# EAGLE design ph-sensor (EAGLE 9.1.1)
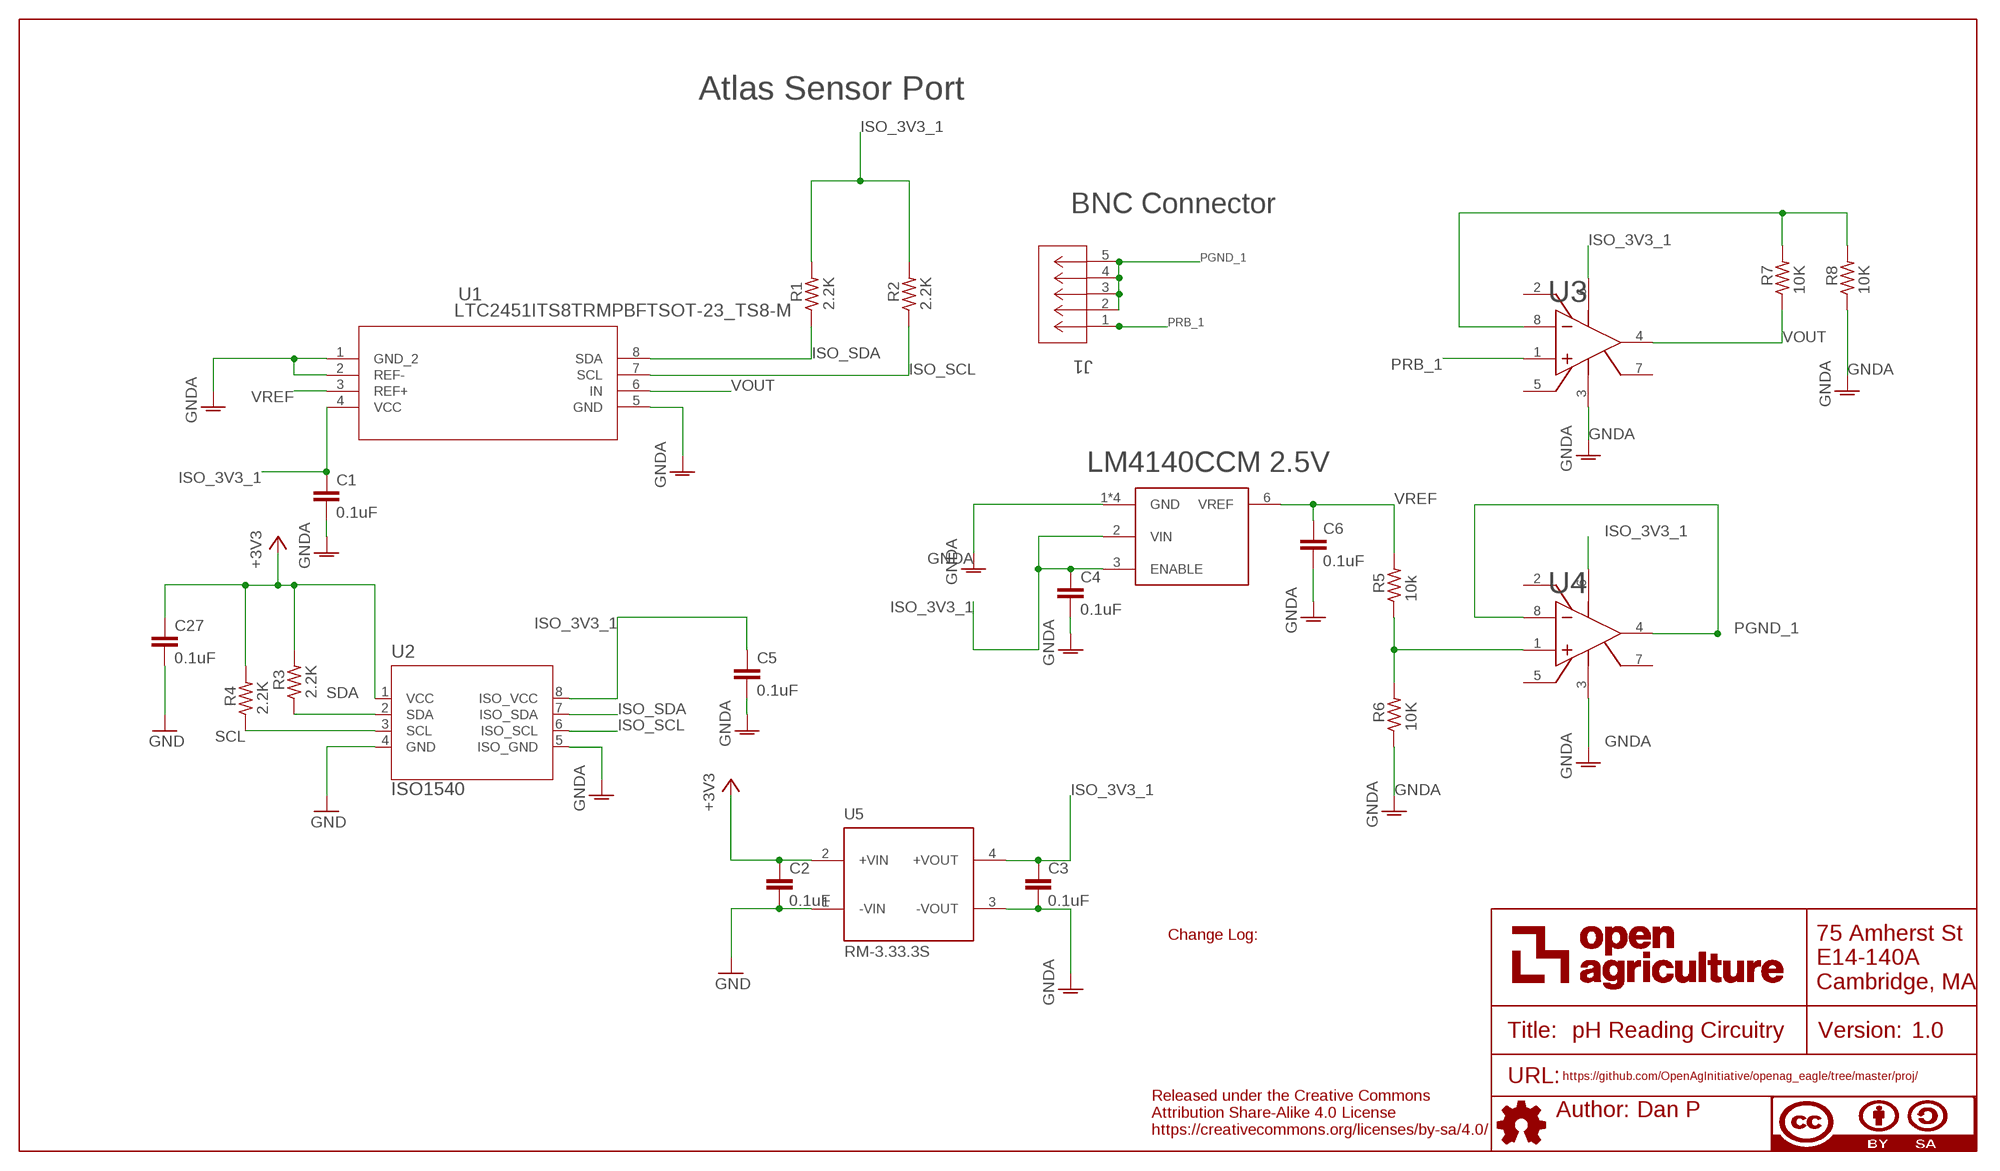
[diagram p0: schematic, sheet 1]
U$4 (DOCFIELD-SCHEMATIC-ONLY): AUTHOR: Dan P; MPN: N/A; TITLE: pH Reading Circuitry; URL: https://github.com/OpenAgInitiative/openag_eagle/tree/master/proj/; VER: 1.0

## Parts
C1  0.1uF  0.1UF-C0603C104K5RACTU  [C0603]
C2  0.1uF  0.1UF-C0603C104K5RACTU  [C0603]
C3  0.1uF  0.1UF-C0603C104K5RACTU  [C0603]
C4  0.1uF  0.1UF-C0603C104K5RACTU  [C0603]
C5  0.1uF  0.1UF-C0603C104K5RACTU  [C0603]
C6  0.1uF  0.1UF-C0603C104K5RACTU  [C0603]
C27  0.1uF  0.1UF-C0603C104K5RACTU  [C0603]
J1  5-1634503-1  [CONN5_5-1634503-1]
R1  2.2K  1K-ERJ-PB3D1001V  [RC0603N]
R2  2.2K  1K-ERJ-PB3D1001V  [RC0603N]
R3  2.2K  1K-ERJ-PB3D1001V  [RC0603N]
R4  2.2K  1K-ERJ-PB3D1001V  [RC0603N]
R5  10k  1K-ERJ-PB3D1001V  [RC0603N]
R6  10K  1K-ERJ-PB3D1001V  [RC0603N]
R7  10K  1K-ERJ-PB3D1001V  [RC0603N]
R8  10K  1K-ERJ-PB3D1001V  [RC0603N]
U1  LTC2451ITS8TRMPBFTSOT-23_TS8-M  [TSOT-23_TS8-M]
U2  ISO1540  ISO1540DR  [D8]
U3  LMP7721MA/NOPBM08A-M  [M08A-M]
U4  LMP7721MA/NOPBM08A-M  [M08A-M]
U5  RM-3.33.3S  RM3.33.3S  [RM3.33.3S-SIP4]
U$5  LM4140CCM_2.5V  LM4140  [SO08]

## Nets
+3V3: C2.1 C27.1 R3.2 R4.2 U2.1(VCC) U5.2(+VIN)
GND: C2.2 C27.2 U2.4(GND) U5.1(-VIN)
GNDA: C1.2 C3.2 C4.2 C5.2 C6.2 R6.1 R8.1 U1.1(GND_2) U1.2(REF-) U1.5(GND) U2.5(ISO_GND) U3.3(V-) U4.3(V-) U5.3(-VOUT) U$5.1(GND) U$5.4(GND) U$5.7(GND) U$5.8(GND)
ISO_3V3_1: C1.1 C3.1 C4.1 C5.1 R1.2 R2.2 U1.4(VCC) U2.8(ISO_VCC) U3.6(V+) U4.6(V+) U5.4(+VOUT) U$5.2(VIN) U$5.3(ENABLE)
ISO_SCL: R2.1 U1.7(SCL) U2.6(ISO_SCL)
ISO_SDA: R1.1 U1.8(SDA) U2.7(ISO_SDA)
N$5: R5.1 R6.2 U4.1(IN+)
N$6: R7.2 R8.2 U3.8(IN-)
PGND_1: J1.2 J1.3 J1.4 J1.5 U4.4(OUT) U4.8(IN-)
PRB_1: J1.1 U3.1(IN+)
SCL: R4.1 U2.3(SCL)
SDA: R3.1 U2.2(SDA)
VOUT: R7.1 U1.6(IN) U3.4(OUT)
VREF: C6.1 R5.2 U1.3(REF+) U$5.6(VREF)
Unconnected: U3.2(NC) U3.5(NC_3) U3.7(NC_2) U4.2(NC) U4.5(NC_3) U4.7(NC_2)

## Notes on the sheet
- Atlas Sensor Port
- BNC Connector
- LM4140CCM 2.5V
- Change Log:
- Released under the Creative Commons
  Attribution Share-Alike 4.0 License
  https://creativecommons.org/licenses/by-sa/4.0/

## Library data of the parts
C1-C6 C27 = openag-capacitors:0.1UF-C0603C104K5RACTU: CAP CER 0.1UF 50V X7R 0603 Description: 0.1µF ±10% 50V Ceramic Capacitor X7R 0603 (1608 Metric) Technical Specifications: Capacitance: 0.1µF Tolerance: ±10% Rated Voltage: 50V Temperature Coefficient: X7R Operating Temperature: -55°C ~ 125°C Package / Case: 0603 (1608 Metric) Datasheet(s): X7R Dielectric, 6.3-250 VDC <https://search.kemet.com/component-edge/download/datasheet/C0603C104K5RACTU.pdf> Vendor(s): Digikey: 399-5089-1-ND <https://www.digikey.com/product-detail/en/kemet/C0603C104K5RACTU/399-5089-1-ND/1465623>; MANUFACTURER: Kemet; MPN: C0603C104K5RACTU; VENDOR: Digikey; VLINK: https://www.digikey.com/product-detail/en/kemet/C0603C104K5RACTU/399-5089-1-ND/1465623; VPN: 399-5089-1-ND
J1 = openag-connectors:5-1634503-1; MANUFACTURER_PART_NUMBER: 516345031; VENDOR: TE Connectivity
R1-R8 = openag-resistors:1K-ERJ-PB3D1001V: RES SMD 1K OHM 0.5% 1/5W 0603 Description: 1 kOhms ±0.5% 0.2W, 1/5W Chip Resistor 0603 (1608 Metric) Automotive AEC-Q200, Pulse Withstanding Thick Film Technical Specifications: Resistance: 1 kOhms Tolerance: ±0.5% Power: 0.2W, 1/5W Operating Temperature: -55°C ~ 155°C Package / Case: 0603 (1608 Metric) Datasheet(s): ERJ-PB3, PB6 Series, High Precision Datasheet <https://industrial.panasonic.com/cdbs/www-data/pdf/RDM0000/AOA0000C328.pdf> Vendor(s): Digikey: P20283CT-ND <https://www.digikey.com/product-detail/en/panasonic-electronic-components/ERJ-PB3D1001V/P20283CT-ND/6214538>; MANUFACTURER: Panasonic; MPN: P20283CT-ND; VALUE: 1K; VENDOR: Digikey; VLINK: https://www.digikey.com/product-detail/en/panasonic-electronic-components/ERJ-PB3D1001V/P20283CT-ND/6214538; VPN: P20283CT-ND
U1 = openag-adc:LTC2451ITS8TRMPBF; MANUFACTURER_PART_NUMBER: LTC2451ITS8#TRMPBF; VENDOR: Linear Technology
U2 = openag-isolators:ISO1540DR: DGTL ISO 2.5KV 2CH I2C 8SOIC Description: I²C Digital Isolator 2500Vrms 2 Channel 1Mbps 25kV/µs CMTI 8-SOIC (0.154", 3.90mm Width) Technical Specifications: Technology: Capacitive Coupling Type: I²C Number of Channels: 2 Channel Type: Bidirectional Voltage-Isolation: 2500Vrms Voltage - Supply: 3 V ~ 5.5 V Data Rate: 1Mbps Operating Temperature: -40°C ~ 125°C Package / Case: 8-SOIC (0.154", 3.90mm Width) Max Supply Current (3V ≤ VCC1, VCC2 ≤ 3.6V) Side 1, Side 2: 3.8mA, 3.1mA Datasheet(s): ISO154x <http://www.ti.com/lit/ds/symlink/iso1540.pdf> Vendor(s): Digikey: 296-34871-1-ND <https://www.digikey.com/product-detail/en/texas-instruments/ISO1540DR/296-34871-1-ND/3587214>; MANUFACTURER: Texas Instruments; MPN: ISO1540DR; VENDOR: Digikey; VLINK: https://www.digikey.com/product-detail/en/texas-instruments/ISO1540DR/296-34871-1-ND/3587214; VPN: 296-34871-1-ND
U3 U4 = openag-sensors:LMP7721MA/NOPB; MANUFACTURER_PART_NUMBER: LMP7721MANOPB; VENDOR: Texas Instruments
U5 = openag-isolators:RM3.33.3S: CONV DC/DC 0.25W SGL 3.3VOUT SIP Description: Isolated Module DC DC Converter 1 Output 3.3V 76mA 3V - 3.6V Input Technical Specifications: Type: Isolated Module Number of Outputs: 1 Voltage - Input (Min): 3V Voltage - Input (Max): 3.6V Voltage - Output 1: 3.3V Current - Output (Max): 76mA Power (Watts): 250mW Voltage - Isolation: 1kV Applications: ITE (Commercial) Features: SCP Operating Temperature: -40°C ~ 85°C Efficiency: 70% Mounting Type: Through Hole Package / Case: 4-SIP Module Size / Dimension: 0.45" L x 0.24" W x 0.39" H (11.5mm x 6.0mm x 10.0mm) Datasheet(s): RM Series Datasheet <https://www.recom-power.com/pdf/Econoline/RM.pdf> Vendor(s): Digikey: 945-1212-ND <https://www.digikey.com/product-detail/en/recom-power/RM-3.33.3S/945-1212-ND/2256392>; MANUFACTURER: Recom Power; MPN: RM-3.33.3S; VENDOR: Digikey; VLINK: https://www.digikey.com/product-detail/en/recom-power/RM-3.33.3S/945-1212-ND/2256392; VPN: 945-1212-ND
U$5 = openag-vref:LM4140

## Net classes
0 default: width 0.305 mm, drill 0.254 mm, clearance 0.254 mm

## Board
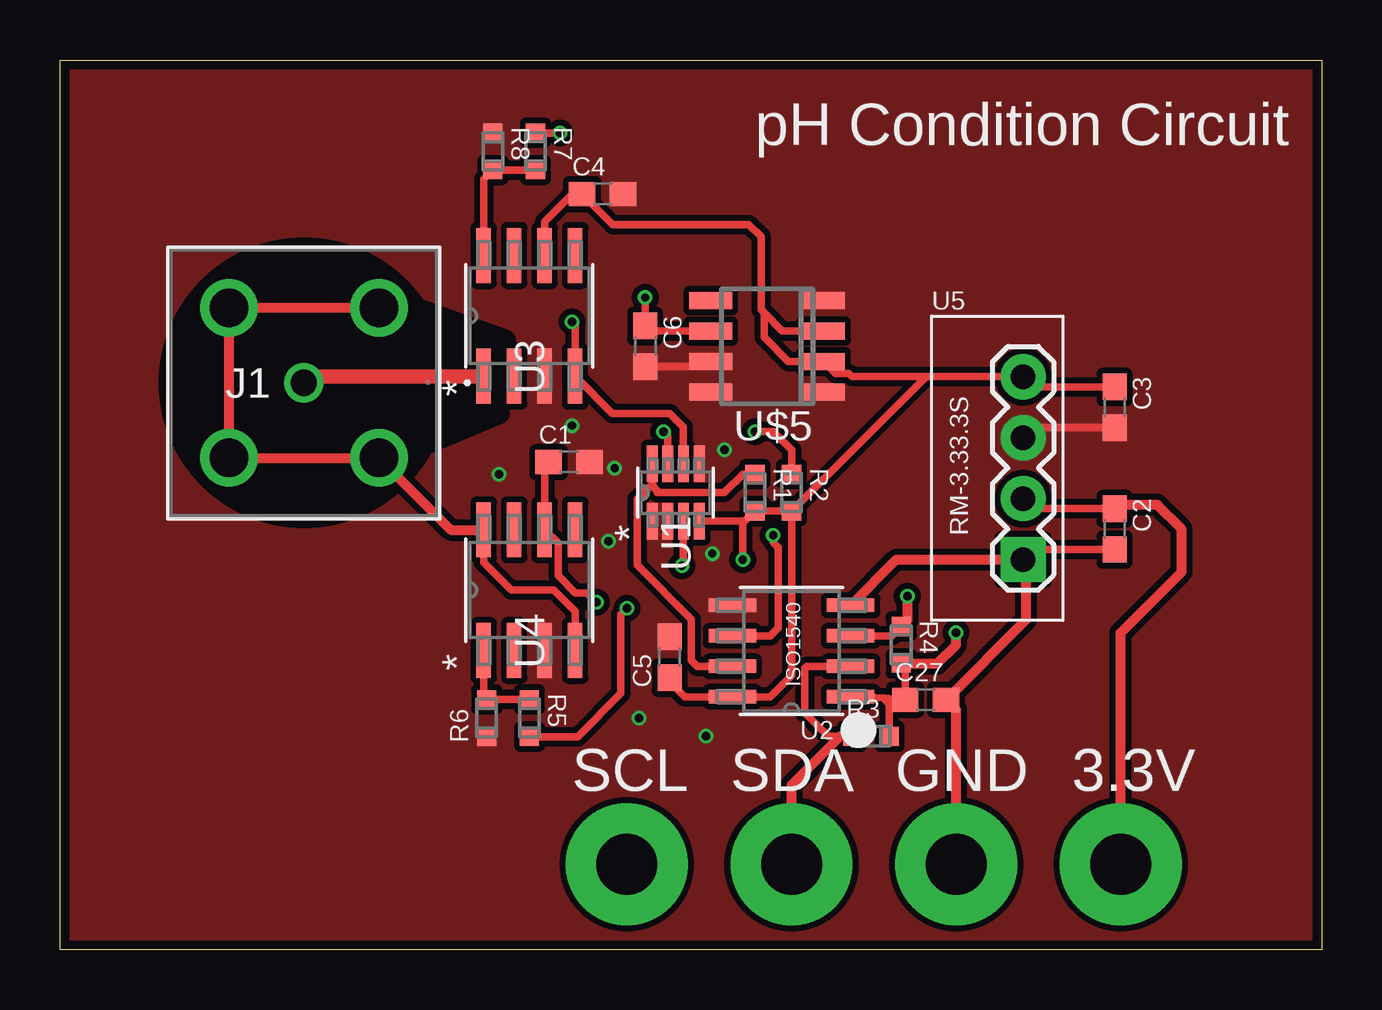
[diagram p1: board, top side]
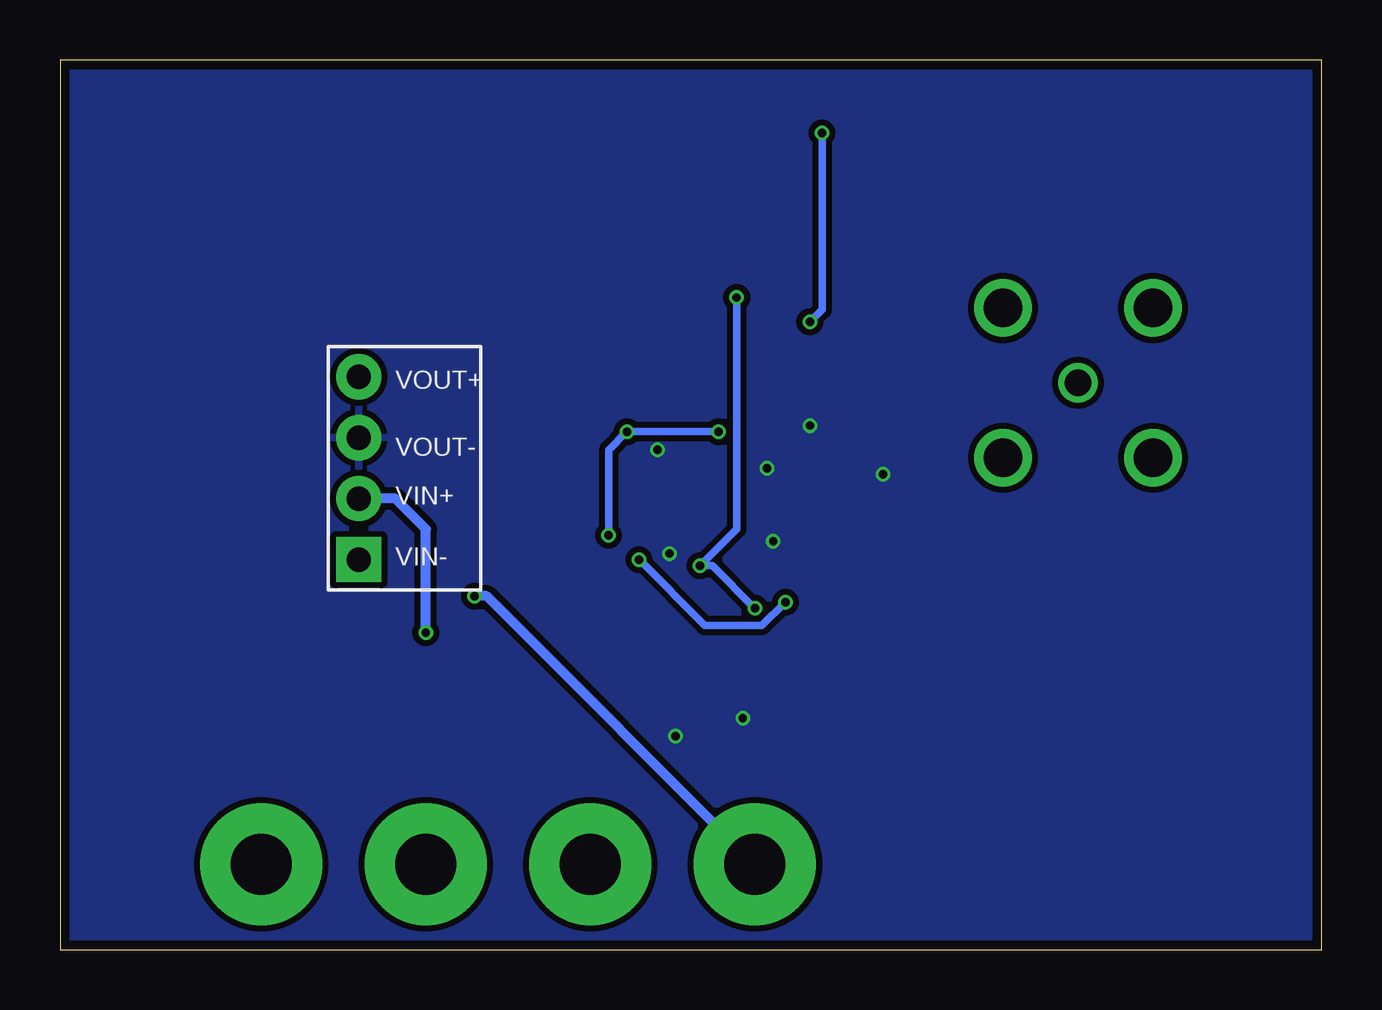
[diagram p2: board, bottom side, seen from below]

Size 52.58 x 37.08 mm. Coordinates in mm from the lower left corner, seen from the top.
Outline: 0,37.08 52.58,37.08 52.58,0 0,0 0,37.08
Copper layers (1*16): Top 0.035559375mm / dielectric 1.6mm / Bottom 0.035559375mm
Design rules "oshpark-2layer-mask": minimum track width 6mil, minimum drill 10mil, track to track 6mil, track to pad 6mil, pad to pad 6mil, via to via 6mil, smd to smd 6mil, copper to edge 15mil, drill to drill 6mil, minimum pad ring 5mil, minimum via ring 5mil, stop-mask expansion 2.5mil, vias tented up to drill 20mil, thermal gap 10mil
tRestrict: area 4.6,18 to 15.8,29.2; 3 lines

### Footprints (pad centres in the part's own frame; a part is rotated, then mirrored left to right if it is on the bottom)
C0603 = smd 1.1 x 1: 1 -0.85,0; 2 0.85,0
CONN5_5-1634503-1 = drill 1.092 pad 1.6: 1 0,0 | drill 1.6 pad 2.108: 2 -3.124,3.124; 3 -3.124,-3.124; 4 3.124,-3.124; 5 3.124,3.124
RC0603N = smd 0.756 x 0.8: 1 -0.778,0; 2 0.778,0
TSOT-23_TS8-M = smd 1.524 x 0.457: 1 -1.194,0.975; 2 -1.194,0.325; 3 -1.194,-0.325; 4 -1.194,-0.975; 5 1.194,-0.975; 6 1.194,-0.325; 7 1.194,0.325; 8 1.194,0.975
D8 = smd 1.981 x 0.559: 1 -2.464,1.905; 2 -2.464,0.635; 3 -2.464,-0.635; 4 -2.464,-1.905; 5 2.464,-1.905; 6 2.464,-0.635; 7 2.464,0.635; 8 2.464,1.905
M08A-M = smd 2.286 x 0.61: 1 -2.515,1.905; 2 -2.515,0.635; 3 -2.515,-0.635; 4 -2.515,-1.905; 5 2.515,-1.905; 6 2.515,-0.635; 7 2.515,0.635; 8 2.515,1.905
RM3.33.3S-SIP4 = drill 1.016 pad 1.88 square: 1 0,0 | drill 1.016 pad 1.88: 2 2.54,0; 3 5.08,0; 4 7.62,0
SO08 = smd 0.72 x 1.78: 1 -1.905,-2.35; 2 -0.635,-2.35; 3 0.635,-2.35; 4 1.905,-2.35; 5 1.905,2.35; 6 0.635,2.35; 7 -0.635,2.35; 8 -1.905,2.35

### Placement (x,y rotation side)
C1  21.21,20.32 0 top
C2  43.94,17.53 270 top
C3  43.94,22.61 270 top
C4  22.61,31.5 0 top
C5  25.4,12.19 90 top
C6  24.38,25.15 270 top
C27  36.07,10.41 0 top
J1  10.16,23.62 0 top
R1  28.96,19.05 270 top
R2  30.48,19.05 270 top
R3  33.78,8.89 0 top
R4  35.05,12.7 270 top
R5  19.56,9.65 270 top
R6  17.78,9.65 90 top
R7  19.81,33.27 270 top
R8  18.03,33.27 270 top
U1  25.65,19.05 90 top
U2  30.48,12.45 180 top
U3  19.56,26.42 90 top
U4  19.56,14.99 90 top
U5  40.13,16.26 90 top
U$5  29.46,25.15 90 top

### Tracks (layer width: path | path; a pad name or v marks a point on that pad's centre or on a via)
+3V3  (via drill 0.35, 2.54 pad 5.08)
  Top 0.305: C2.1 43.69,18.38 40.55,18.38 U5.2 | 34.3,10.48 C27.1 35.22,11.76 R4.2 | 34.3,10.48 32.98,10.58 U2.1 | R3.2 34.56,10.22 34.3,10.48
  Top 0.406: R4.2 36.56,11.92 37.34,12.7 v37.34,13.21 | v44.2,3.56 44.2,13.21 46.74,15.75 46.74,17.53 45.72,18.54 43.85,18.54 43.69,18.38
  Bottom 0.406: v37.34,13.21 37.34,17.53 38.61,18.8 U5.2
GND  (via drill 2.54 pad 5.08)
  Top 0.305: C2.2 40.55,16.68 40.26,16.38 U5.1
  Top 0.406: 40.26,16.38 40.26,13.76 C27.2 37.34,9.99 v37.34,3.56 | U2.4 34.85,16.26 U5.1
GNDA  (via drill 0.35)
  Top 0.305: C3.2 40.55,21.76 U5.3 | U$5.7 26.9,24.3 C6.2
  other vias: 27.18,16.51 22.86,17.02 23.11,20.07 27.69,20.83 18.29,19.81 21.34,21.84 24.13,9.65 26.92,8.89
  pour Top (isolate 0.254, no thermals): 0,37.08 0,0 52.58,0 52.58,37.08 2.54,37.08
  pour Bottom (isolate 0.254): 0,37.08 52.83,37.08 52.83,-0.51 0,-0.51 0,2.79
ISO_3V3_1  (via drill 0.35)
  Top 0.305: C3.1 40.55,23.46 U5.4 36.08,23.88 | C1.1 20.19,20.15 U4.6 20.75,16.94 20.75,15.6 21.48,14.87 21.96,14.87 v22.35,14.48 | U3.6 20.19,30.35 21.34,31.5 C4.1 23.03,30.23 28.7,30.23 29.21,29.72 29.21,26.67 29.34,26.54 | U$5.3 30.1,25.78 29.34,26.54 | 29.34,26.54 29.34,25.65 29.34,25.53 30.35,24.51 U$5.2 32.32,24.01 32.87,24.01 33,23.88 36.08,23.88 | U1.4 28.45,17.86 | 28.45,17.86 28.54,17.86 R1.2 R2.2 | R2.2 36.08,23.88 | C5.1 25.4,11.18 26.04,10.54 U2.8 29.59,10.54 30.48,11.43 R2.2 | v28.45,16.26 28.45,17.86
  Bottom 0.305: v22.35,14.48 22.37,14.48 23.33,13.52 25.71,13.52 v28.45,16.26
ISO_SCL  (via drill 0.35)
  Top 0.305: U1.7 25.33,21.41 v25.15,21.59 | v28.96,21.59 29.72,21.59 30.48,20.83 R2.1 | U2.6 29.59,13.08 29.92,13.41 29.92,16.76 29.72,16.97 v29.72,17.27
  Bottom 0.305: v25.15,21.59 v28.96,21.59 29.72,20.83 v29.72,17.27
ISO_SDA
  Top 0.305: R1.1 28.46,19.83 27.69,19.05 24.89,19.05 24.89,19.11 24.69,19.31 24.69,19.56 | 24.69,19.56 24.69,20.23 U1.8 | U2.7 26.54,11.81 26.31,12.05 26.31,13.76 24.04,16.02 24.04,18.79 24.69,19.44 24.69,19.56
N$5
  Top 0.305: 17.51,12.33 U4.1 17.65,10.56 R6.2 R5.1
N$6
  Top 0.305: U3.8 17.65,32.12 R8.2 R7.2
PGND_1
  Top 0.305: U4.4 21.46,14.1 20.57,14.99 18.8,14.99 17.78,16 17.65,16.13 U4.8
  Top 0.406: J1.5 J1.2 J1.3 J1.4 16.28,17.5 U4.8
PRB_1
  Top 0.305: 17.65,23.88 U3.1
  Top 0.406: J1.1 10.41,23.88
  Top 0.61: 10.41,23.88 17.65,23.88
SCL  (via drill 0.35, 2.54 pad 5.08)
  Top 0.305: U2.3 34.66,13.08 R4.1
  Top 0.406: v35.31,14.73 35.31,13.73 R4.1
  Bottom 0.406: v23.62,3.56 34.8,14.73 v35.31,14.73
SDA  (via drill 2.54 pad 5.08)
  Top 0.305: U2.2 31.11,11.81 31.04,11.73 31.04,9.86 32,8.89 32.51,8.89 R3.1
  Top 0.406: v30.48,3.56 30.48,6.86 32.51,8.89
VOUT  (via drill 0.35)
  Top 0.305: U1.6 25.98,21.77 25.4,22.35 23.01,22.35 U3.4 21.46,26.04 v21.34,26.16 | R7.1 19.83,34.04 v20.83,34.04
  Bottom 0.305: v20.83,34.04 20.83,26.67 v21.34,26.16
VREF  (via drill 0.35)
  Top 0.305: 19.57,8.89 R5.2 21.57,8.87 23.37,10.67 23.37,13.97 v23.62,14.22 | U$5.6 25.65,25.78 24.6,25.78 C6.1 v24.38,27.18 | v25.91,16 25.98,16.07 U1.3
  Bottom 0.305: v24.38,27.18 24.38,17.53 v25.91,16 25.4,16 v23.62,14.22

### Text on the board
tNames: pH Condition Circuit | SCL | SDA | GND | 3.3V